# Altium schematic sheet esp32.SchDoc
size A3
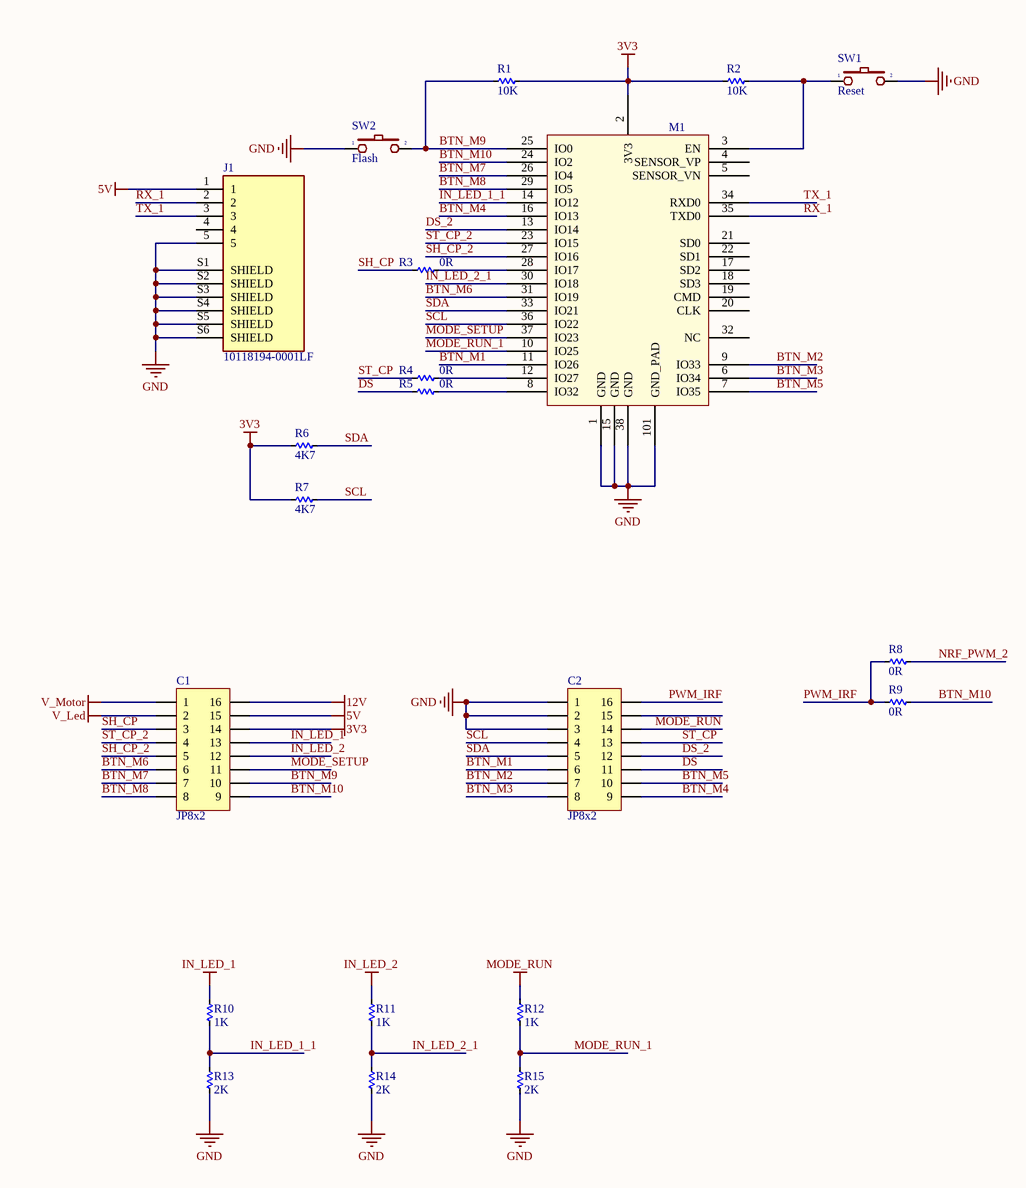
[diagram p0: esp32.SchDoc]

## Parts
C1  JP8x2  [JP8-C2T]
C2  JP8x2  [JP8-C2T]
J1  10118194-0001LF  [AMPHENOL_10118194-0001LF]
M1  ESP32S_Module  [ESP32S]  (value not drawn)
R1  10K  [RES-SMD-0603]
R2  10K  [RES-SMD-0603]
R3  0R  [RES-SMD-0603]
R4  0R  [RES-SMD-0603]
R5  0R  [RES-SMD-0603]
R6  4K7  [RES-SMD-0603]
R7  4K7  [RES-SMD-0603]
R8  0R  [RES-SMD-0603]
R9  0R  [RES-SMD-0603]
R10  1K  [RES-SMD-0603]
R11  1K  [RES-SMD-0603]
R12  1K  [RES-SMD-0603]
R13  2K  [RES-SMD-0603]
R14  2K  [RES-SMD-0603]
R15  2K  [RES-SMD-0603]
SW1  Reset  [SW1-SMD]
SW2  Flash  [SW-DIP1-1]

## Nets
3V3: C1.14 M1.2(3V3) R1.1 R2.2 R6.1 R7.1
5V: C1.15 J1.1
12V: C1.16
GND: C2.1 C2.2 C2.3 J1.5 J1.S1(SHIELD) J1.S2(SHIELD) J1.S3(SHIELD) J1.S4(SHIELD) J1.S5(SHIELD) J1.S6(SHIELD) M1.1(GND) M1.15(GND) M1.38(GND) M1.101(GND_PAD) R13.1 R14.1 R15.1 SW1.2 SW2.1
IN_LED_1: C1.13 R10.2
IN_LED_2: C1.12 R11.2
MODE_RUN: C2.14 R12.2
V_Led: C1.2
V_Motor: C1.1
BTN_M1: C2.6 M1.11(IO26)
BTN_M2: C2.7 M1.9(IO33)
BTN_M3: C2.8 M1.6(IO34)
BTN_M4: C2.9 M1.16(IO13)
BTN_M5: C2.10 M1.7(IO35)
BTN_M6: C1.6 M1.31(IO19)
BTN_M7: C1.7 M1.26(IO4)
BTN_M8: C1.8 M1.29(IO5)
BTN_M9: C1.10 M1.25(IO0) R1.2 SW2.2
BTN_M10: C1.9 M1.24(IO2) R9.1
DS: C2.11 R5.1
DS_2: C2.12 M1.13(IO14)
IN_LED_1_1: M1.14(IO12) R10.1 R13.2
IN_LED_2_1: M1.30(IO18) R11.1 R14.2
MODE_RUN_1: M1.10(IO25) R12.1 R15.2
MODE_SETUP: C1.11 M1.37(IO23)
NRF_PWM_2: R8.1
PWM_IRF: C2.16 R8.2 R9.2
RX_1: J1.2 M1.35(TXD0)
SCL: C2.4 M1.36(IO22) R7.2
SDA: C2.5 M1.33(IO21) R6.2
SH_CP: C1.3 R3.1
SH_CP_2: C1.5 M1.27(IO16)
ST_CP: C2.13 R4.1
ST_CP_2: C1.4 M1.23(IO15)
TX_1: J1.3 M1.34(RXD0)
NetM1_3: M1.3(EN) R2.1 SW1.1
NetM1_8: M1.8(IO32) R5.2
NetM1_12: M1.12(IO27) R4.2
NetM1_28: M1.28(IO17) R3.2

Not connected (* = marked no-connect by the designer): C2 15; J1 4; M1 4(SENSOR_VP) 5(SENSOR_VN) 17(SD2) 18(SD3) 19(CMD) 20(CLK) 21(SD0) 22(SD1) 32(NC)

## Library data of the parts
C1 C2 = JP8x2: WR-PHD 2.54 mm Dual Socket Header; Manufacturer: W¨¹rth Elektronik eiSos GmbH; partNo: 61301621821; ComponentLink1 Description: Manufacturer; ComponentLink2 Description: Datasheet; NoPins: 16; Created Date: 29 March 2013; ComponentLink1URL: http://www.we-online.com; ComponentLink2URL: http://katalog.we-online.de/em/datasheet/6130xx21821.pdf; Created by: Karrer Zheng
J1 = 10118194-0001LF: USB - micro B USB 2.0 Receptacle Connector 5 Position Surface Mount, Right Angle; Through Hole; MF: Amphenol ICC; Package: None; Price: None; Availability: Unavailable; MP: 10118194-0001LF; SnapEDA_Link: https://www.snapeda.com/parts/10118194-0001LF/Amphenol%20FCI/view-part/1413308/?ref=snap; Value: *
M1 = ESP32S_Module: Esp-32S; Datasheet: https://espressif.com/sites/default/files/documentation/esp_wroom_32_datasheet_en.pdf
R1-R15 = Res-SMD: Resistor; Manufacturer: Generic Components; Class: Passive; Published: 08/06/2000; Publisher: Altium Hobart Technology Centre
SW1 SW2 = SW2: Switch button 2 pin; Value: SW chip 2 pin